# EAGLE design Receiver (EAGLE 4.16)
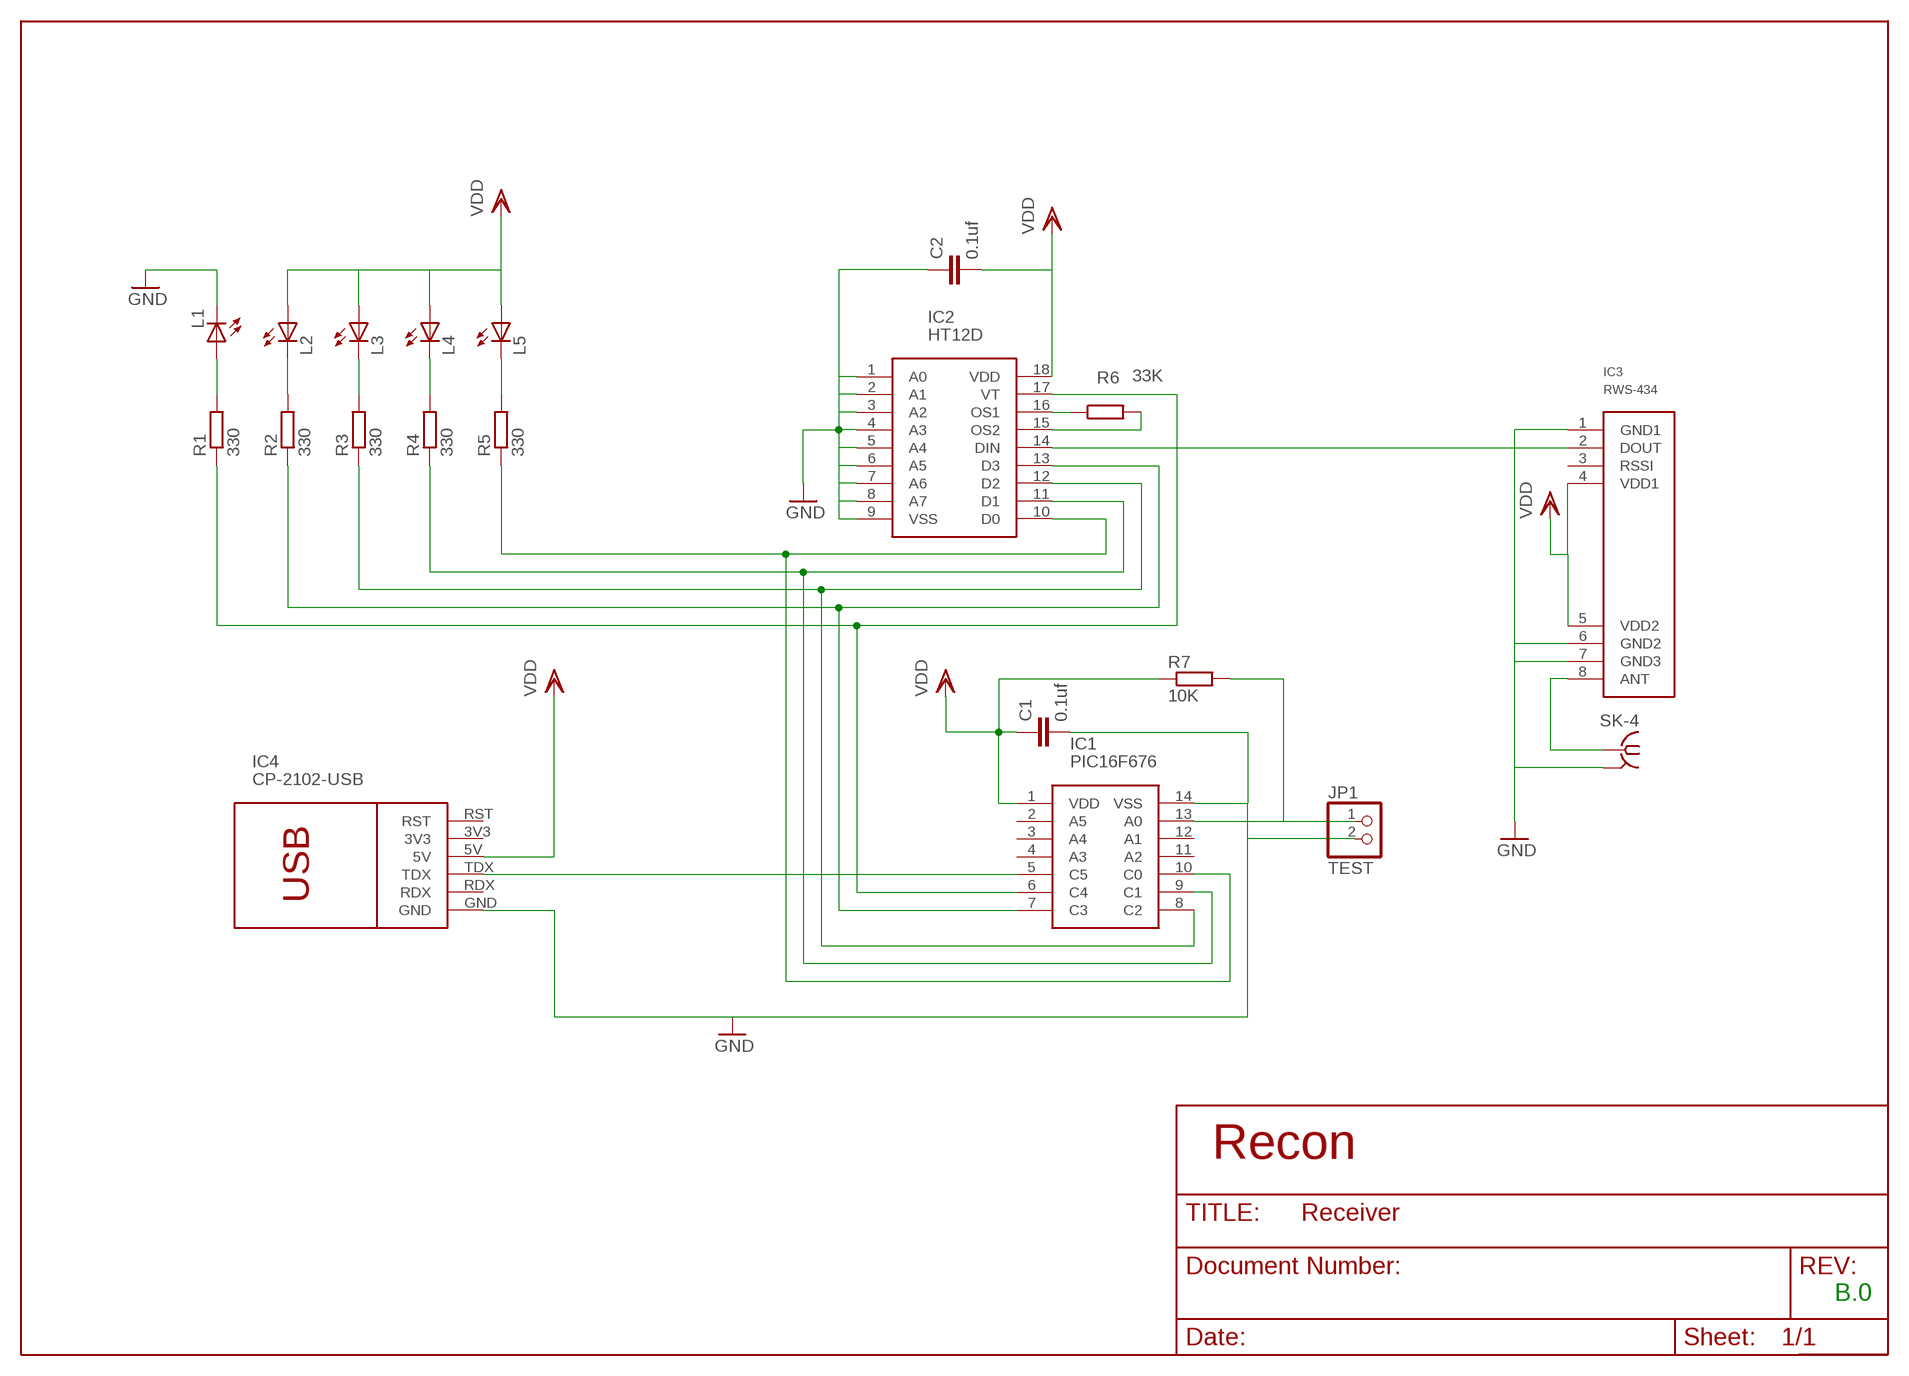
[diagram p0: schematic, sheet 1]

## Parts
C1  0.1uf  C-EU025-030X050  [C025-030X050]
C2  0.1uf  C-EU025-030X050  [C025-030X050]
IC1  PIC16F676  [DIL14]
IC2  HT12D  [DIL18]
IC3  RWS-434  [RWS_434]
IC4  CP-2102-USB  [CP2102_MODULE]
JP1  TEST  PINHD-1X2  [1X02]
L1  LED3MM  [LED3MM]
L2  LED3MM  [LED3MM]
L3  LED3MM  [LED3MM]
L4  LED3MM  [LED3MM]
L5  LED3MM  [LED3MM]
R1  330  R-EU_0207/10  [0207/10]
R2  330  R-EU_0207/10  [0207/10]
R3  330  R-EU_0207/10  [0207/10]
R4  330  R-EU_0207/10  [0207/10]
R5  330  R-EU_0207/10  [0207/10]
R6  33K  R-EU_0207/10  [0207/10]
R7  10K  R-EU_0207/10  [0207/10]
SK-4  BU-SMA-V  [BU-SMA-V]

## Nets
D0: IC1.10(C0) IC2.10(D0) R5.1
D1: IC1.9(C1) IC2.11(D1) R4.1
D2: IC1.8(C2) IC2.12(D2) R3.1
D3: IC1.7(C3) IC2.13(D3) R2.1
DIN: IC2.14(DIN) IC3.2(DOUT)
GND: C1.2 C2.1 IC1.14(VSS) IC2.1(A0) IC2.2(A1) IC2.3(A2) IC2.4(A3) IC2.5(A4) IC2.6(A5) IC2.7(A6) IC2.8(A7) IC2.9(VSS) IC3.1(GND1) IC3.6(GND2) IC3.7(GND3) IC4.GND JP1.2 L1.K(C) SK-4.2(GND)
N$1: IC1.13(A0) JP1.1 R7.2
N$2: IC2.16(OS1) R6.1
N$3: IC3.8(ANT) SK-4.1
N$4: IC2.15(OS2) R6.2
N$6: L1.A R1.2
N$13: L2.K(C) R2.2
N$14: L3.K(C) R3.2
N$15: L4.K(C) R4.2
N$16: L5.K(C) R5.2
TXD: IC1.5(C5) IC4.TDX
VDD: C1.1 C2.2 IC1.1(VDD) IC2.18(VDD) IC3.4(VDD1) IC3.5(VDD2) IC4.5V L2.A L3.A L4.A L5.A R7.1
VT: IC1.6(C4) IC2.17(VT) R1.1
Unconnected: IC3.3(RSSI) IC4.3V3 IC4.RDX IC4.RST

## Notes on the sheet
- B.0

## Power pins joined to a net without a drawn wire
A1: IC1.12(A1)
A2: IC1.11(A2)
A3: IC1.4(A3)
A4: IC1.3(A4)
A5: IC1.2(A5)
GND: SK-4.3(GND) SK-4.4(GND) SK-4.5(GND)

## Library data of the parts
C1 C2 = Recon:C-EU: CAPACITOR, European symbol
IC1 = Recon:PIC16F676
IC2 = Recon:HT12D
IC3 = Recon:RWS-434
IC4 = Recon:CP-2102-USB
JP1 = Headers:PINHD-1X2: PIN HEADER
L1-L5 = Recon:LED: LED OSRAM: - CHIPLED LG R971, LG N971, LY N971, LG Q971, LY Q971, LO R971, LY R971 LH N974, LH R974 LS Q976, LO Q976, LY Q976 LO Q996 - Hyper CHIPLED LW Q18S LB Q993, LB Q99A, LB R99A - SideLED LS A670, LO A670, LY A670, LG A670, LP A670 LB A673, LV A673, LT A673, LW A673 LH A674 LY A675 LS A676, LA A676, LO A676, LY A676, LW A676 LS A679, LY A679, LG A679 - Hyper Micro SIDELED® LS Y876, LA Y876, LO Y876, LY Y876 LT Y87S - SmartLED LW L88C, LW L88S LB L89C, LB L89S, LG L890 LS L89K, LO L89K, LY L89K LS L896, LA L896, LO L896, LY L896 - TOPLED LS T670, LO T670, LY T670, LG T670, LP T670 LSG T670, LSP T670, LSY T670, LOP T670, LYG T670 LG T671, LOG T671, LSG T671 LB T673, LV T673, LT T673, LW T673 LH T674 LS T676, LA T676, LO T676, LY T676, LB T676, LH T676, LSB T676, LW T676 LB T67C, LV T67C, LT T67C, LS T67K, LO T67K, LY T67K, LW E67C LS E67B, LA E67B, LO E67B, LY E67B, LB E67C, LV E67C, LT E67C LW T67C LS T679, LY T679, LG T679 LS T770, LO T770, LY T770, LG T770, LP T770 LB T773, LV T773, LT T773, LW T773 LH T774 LS E675, LA E675, LY E675, LS T675 LS T776, LA T776, LO T776, LY T776, LB T776 LHGB T686 LT T68C, LB T68C - Hyper Mini TOPLED® LB M676 - Mini TOPLED Santana® LG M470 LS M47K, LO M47K, LY M47K Source: http://www.osram.convergy.de - LUMILED® LXK2-PW12-R00, LXK2-PW12-S00, LXK2-PW14-U00, LXK2-PW14-V00 LXK2-PM12-R00, LXK2-PM12-S00, LXK2-PM14-U00 LXK2-PE12-Q00, LXK2-PE12-R00, LXK2-PE12-S00, LXK2-PE14-T00, LXK2-PE14-U00 LXK2-PB12-K00, LXK2-PB12-L00, LXK2-PB12-M00, LXK2-PB14-N00, LXK2-PB14-P00, LXK2-PB14-Q00 LXK2-PR12-L00, LXK2-PR12-M00, LXK2-PR14-Q00, LXK2-PR14-R00 LXK2-PD12-Q00, LXK2-PD12-R00, LXK2-PD12-S00 LXK2-PH12-R00, LXK2-PH12-S00 LXK2-PL12-P00, LXK2-PL12-Q00, LXK2-PL12-R00 Source: www.luxeon.com
R1-R7 = Recon:R-EU_: RESISTOR, European symbol
SK-4 = Recon:BU-SMA-V: FEMALE SMA CONNECTOR Radiall distributor RS 112-3794

## Board
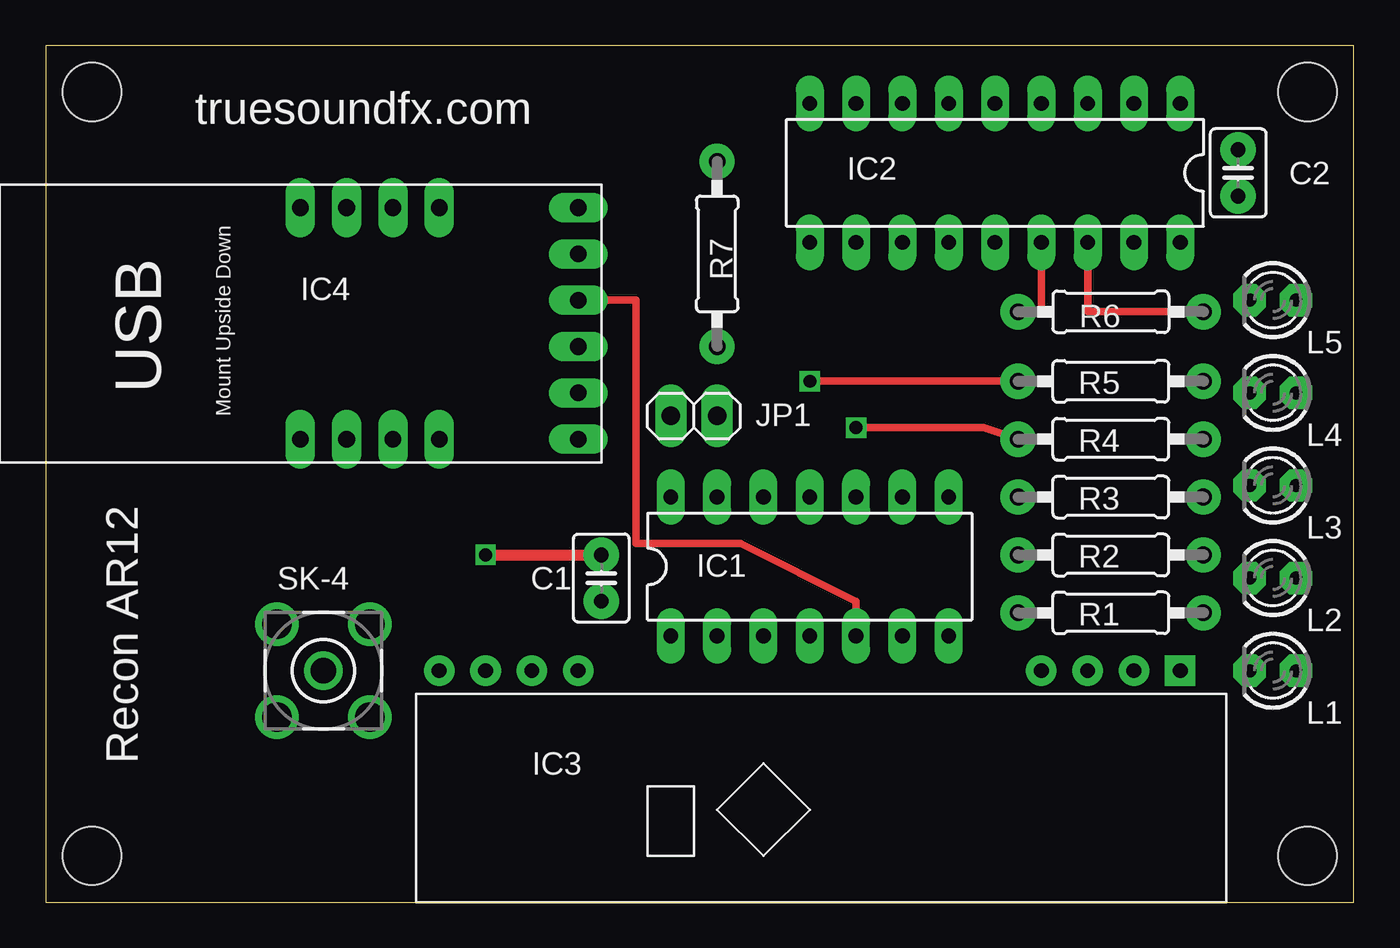
[diagram p1: board, top side]
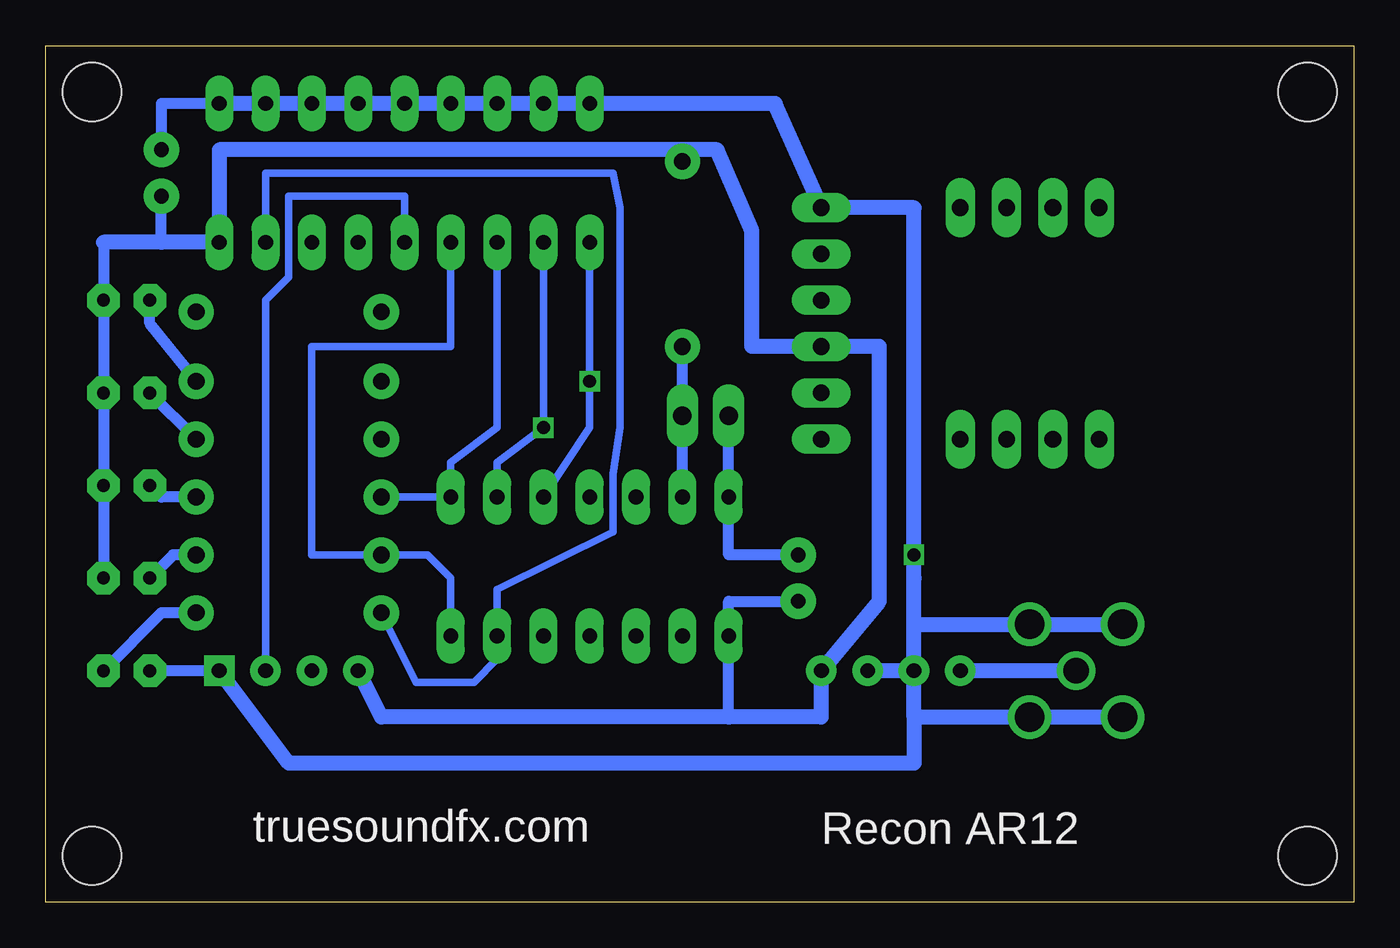
[diagram p2: board, bottom side, seen from below]

Size 71.75 x 46.99 mm. Coordinates in mm from the lower left corner, seen from the top.
Outline: 0,0 71.75,0 71.75,46.99 0,46.99 0,0
Copper layers (1*16): Top 0.035mm / dielectric 0.2mm / Bottom 0.035mm
Design rules "default": minimum track width 10mil, minimum drill 24mil, track to track 16mil, track to pad 12mil, pad to pad 8mil, via to via 8mil, smd to smd 8mil, copper to edge 40mil, drill to drill 8mil, minimum pad ring 14mil, minimum via ring 8mil, stop-mask expansion 4mil, vias tented up to drill 0mil, thermal gap 10mil
Holes 3.2 mm at 2.54,2.54 69.22,2.54 69.22,44.45 2.54,44.45

### Footprints (pad centres in the part's own frame; a part is rotated, then mirrored left to right if it is on the bottom)
C025-030X050 = drill 0.813 pad 1.93 round: 1 -1.27,0; 2 1.27,0
DIL14 = drill 0.813 long: 1 -7.62,-3.81; 2 -5.08,-3.81; 3 -2.54,-3.81; 4 0,-3.81; 5 2.54,-3.81; 6 5.08,-3.81; 7 7.62,-3.81; 8 7.62,3.81; 9 5.08,3.81; 10 2.54,3.81; 11 0,3.81; 12 -2.54,3.81; 13 -5.08,3.81; 14 -7.62,3.81
DIL18 = drill 0.813 long: 1 -10.16,-3.81; 2 -7.62,-3.81; 3 -5.08,-3.81; 4 -2.54,-3.81; 5 0,-3.81; 6 2.54,-3.81; 7 5.08,-3.81; 8 7.62,-3.81; 9 10.16,-3.81; 10 10.16,3.81; 11 7.62,3.81; 12 5.08,3.81; 13 2.54,3.81; 14 0,3.81; 15 -2.54,3.81; 16 -5.08,3.81; 17 -7.62,3.81; 18 -10.16,3.81
RWS_434 = drill 0.813 pad 1.676 square: 1 -5.08,27.94 | drill 0.813 pad 1.676 round: 2 -5.08,25.4; 3 -5.08,22.86; 4 -5.08,20.32; 5 -5.08,-5.08; 6 -5.08,-7.62; 7 -5.08,-10.16; 8 -5.08,-12.7
CP2102_MODULE = drill 0.914 long: 3V3 0,2.54; 5V 0,5.08; GND 0,12.7; P$7 -7.62,0; P$8 -10.16,0; P$9 -12.7,0; P$10 -15.24,0; P$11 -7.62,12.7; P$12 -10.16,12.7; P$13 -12.7,12.7; P$14 -15.24,12.7; RDX 0,10.16; RST 0,0; TDX 0,7.62
1X02 = drill 1.016 long: 1 -1.27,0; 2 1.27,0
LED3MM = drill 0.711 pad 1.778 octagon: A -1.27,0; K 1.27,0
0207/10 = drill 0.914 pad 1.93 round: 1 -5.08,0; 2 5.08,0
BU-SMA-V = drill 1.4 round: 1 0,0 | drill 1.6 round: 2 -2.55,2.55; 3 2.55,2.55; 4 2.55,-2.55; 5 -2.55,-2.55

### Placement (x,y rotation side)
C1  30.48,17.78 90 top
C2  65.41,40.01 270 top
IC1  41.91,18.41 0 top
IC2  52.07,40.01 180 top
IC3  34.29,7.62 270 top
IC4  29.21,25.4 0 top
JP1  35.56,26.67 180 top
L1  67.31,12.7 180 top
L2  67.31,17.78 180 top
L3  67.31,22.86 180 top
L4  67.31,27.94 180 top
L5  67.31,33.02 180 top
R1  58.42,15.88 0 top
R2  58.42,19.05 0 top
R3  58.42,22.23 0 top
R4  58.42,25.4 0 top
R5  58.42,28.57 0 top
R6  58.42,32.38 180 top
R7  36.83,35.56 270 top
SK-4  15.24,12.7 0 top

### Tracks (layer width: path | path; a pad name or v marks a point on that pad's centre or on a via)
D0  (via drill 0.71)
  Top 0.406: v41.91,28.57 R5.1
  Bottom 0.406: IC1.10 41.91,26.04 v41.91,28.57 IC2.10
D1  (via drill 0.71)
  Top 0.406: R4.1 51.44,26.04 v44.45,26.04
  Bottom 0.406: IC1.9 46.99,22.86 46.99,24.13 v44.45,26.04 IC2.11
D2
  Bottom 0.406: IC2.12 46.99,26.04 49.53,24.13 IC1.8 R3.1
D3
  Bottom 0.406: IC2.13 49.53,30.48 57.15,30.48 57.15,19.05 R2.1 50.8,19.05 49.53,17.78 IC1.7
DIN
  Bottom 0.406: IC3.2 59.69,33.02 58.42,34.29 58.42,38.73 52.07,38.73 IC2.14
GND  (via drill 0.71)
  Top 0.61: v24.13,19.06 C1.2
  Bottom 0: IC2.8 IC2.7 | IC2.7 IC2.6 | IC2.6 IC2.5 | IC2.5 IC2.4 | IC2.4 IC2.3 | IC2.3 IC2.2 | IC2.2 IC2.1 IC2.2 | IC2.7 IC2.6 | IC2.6 IC2.5 | IC2.5 IC2.4 | IC2.4 IC2.3 | IC2.3 IC2.2
  Bottom 0.406: IC3.1 64.77,12.7
  Bottom 0.61: IC2.1 65.41,43.81 C2.1 | IC1.14 34.29,21.59 | C1.2 34.29,19.05 IC1.14 | IC3.1 L1.K | IC1.14 JP1.2
  Bottom 0.813: IC3.7 IC3.6 | IC3.1 58.42,7.62 24.13,7.62 24.13,10.16 | 24.13,10.16 IC3.7 | IC2.1 IC2.2 IC2.3 IC2.4 IC2.5 IC2.6 IC2.7 IC2.8 IC2.9 31.75,43.81 IC4.GND 24.13,38.1 24.13,17.78 | SK-4.4 | IC3.7 24.13,15.24 | 24.13,15.24 24.13,17.78 | 24.13,17.78 v24.13,19.06 | SK-4.4 24.13,10.15 24.13,10.16 | SK-4.5 | SK-4.5 SK-4.4 | SK-4.5 | 24.13,15.24 24.13,15.25 SK-4.3 | SK-4.3 SK-4.2 | SK-4.3
N$1
  Bottom 0.61: IC1.13 JP1.1 R7.2
N$2
  Top 0.406: IC2.16 57.15,32.38 R6.1
N$3
  Bottom 0.813: SK-4.1 IC3.8
N$4
  Top 0.406: R6.2 54.61,32.38 IC2.15
N$6
  Bottom 0.61: R1.2 65.41,15.88 L1.A
N$13
  Bottom 0.61: R2.2 64.77,19.05 L2.K
N$14
  Bottom 0.61: R3.2 65.41,22.23 L3.K
N$15
  Bottom 0.61: R4.2 L4.K
N$16
  Bottom 0.61: R5.2 66.04,31.75 L5.K
TXD
  Top 0.406: IC1.5 44.45,16.51 38.1,19.68 32.38,19.68 32.38,33.02 IC4.TDX
VDD
  Bottom 0.61: 34.29,10.16 IC1.1 34.29,16.51 C1.1 | 65.41,36.2 C2.2 | 68.58,36.2 L5.A L4.A L3.A L2.A | R7.1 36.83,41.27 37.15,41.27
  Bottom 0.813: 68.58,36.2 65.41,36.2 IC2.18 62.23,41.27 37.15,41.27 34.92,41.27 33.02,36.83 33.02,30.48 IC4.5V 26.04,30.48 26.04,16.51 IC3.5 29.21,10.16 34.29,10.16 53.34,10.16 IC3.4
VT
  Bottom 0.406: IC2.17 59.69,40.01 40.64,40.01 40.26,38.1 40.26,26.04 40.64,23.5 40.64,20.32 46.99,17.14 IC1.6 46.99,13.34 48.26,12.06 51.44,12.06 R1.1

### Text on the board
tPlace: truesoundfx.com | Recon AR12
bPlace: truesoundfx.com | Recon AR12
Drill_legend: Drill legend | Date: 11/20/2012 09:12:19a | 3.2000 mm / 125.984 mil | 1.6000 mm / 62.992 mil | 1.4000 mm / 55.118 mil | 1.0160 mm / 40.000 mil | 0.9144 mm / 36.000 mil | 0.8128 mm / 32.000 mil | 0.7112 mm / 28.000 mil